# Altium schematic sheet Sheet_1 copy_2020-10-16_22-50-58.schdoc
size 312 x 186 mm
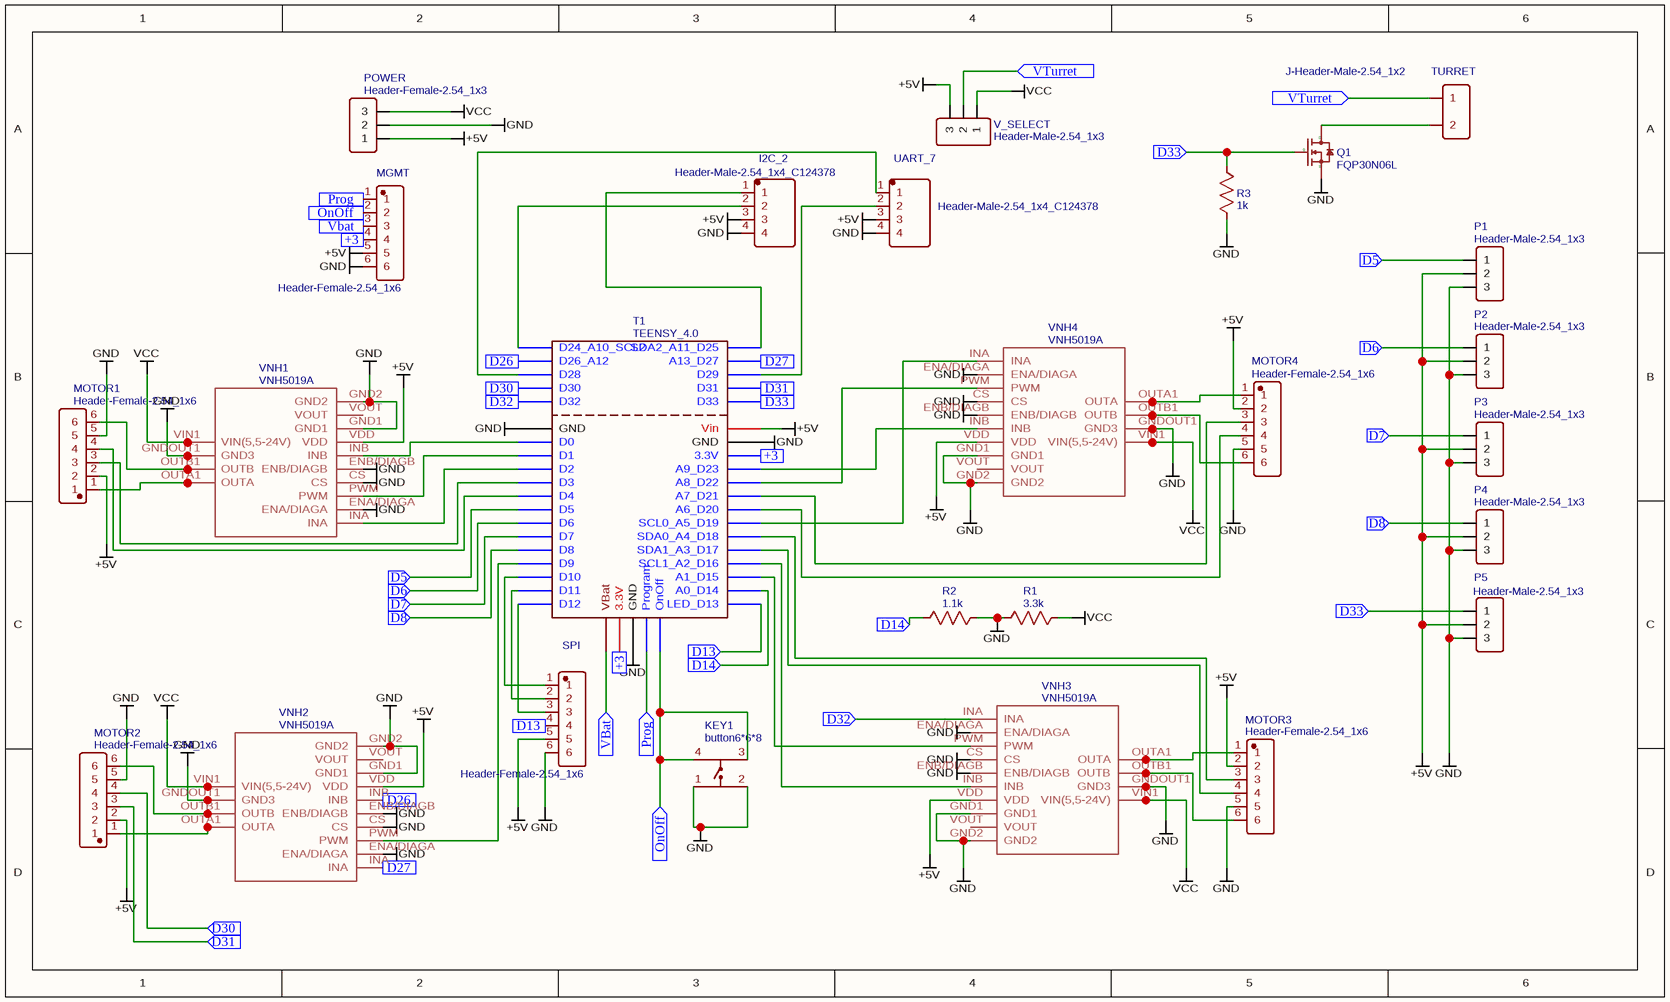
[diagram p0: Sheet_1 copy_2020-10-16_22-50-58.schdoc]

## Parts
I2C_2  Header-Male-2.54_1x4_C124378  [HDR-TH_4P-P2.54-V]
KEY1  button6*6*8  [KEY-TH_4P-L6.0-W6.0-P4.50-LS7.5]
MGMT  Header-Female-2.54_1x6  [HDR-TH_6P-P2.54-V]
MOTOR1  Header-Female-2.54_1x6  [HDR-TH_6P-P2.54-V]
MOTOR2  Header-Female-2.54_1x6  [HDR-TH_6P-P2.54-V]
MOTOR3  Header-Female-2.54_1x6  [HDR-TH_6P-P2.54-V]
MOTOR4  Header-Female-2.54_1x6  [HDR-TH_6P-P2.54-V]
P1  Header-Male-2.54_1x3  [HDR-TH_3P-P2.54-V]
P2  Header-Male-2.54_1x3  [HDR-TH_3P-P2.54-V]
P3  Header-Male-2.54_1x3  [HDR-TH_3P-P2.54-V]
P4  Header-Male-2.54_1x3  [HDR-TH_3P-P2.54-V]
P5  Header-Male-2.54_1x3  [HDR-TH_3P-P2.54-V]
POWER  Header-Female-2.54_1x3  [HDR-TH_3P-P2.54-V]
Q1  FQP30N06L  [TO-220]
R1  3.3k  [R0603]
R2  1.1k  [R0603]
R3  1k  [R0603]
SPI  Header-Female-2.54_1x6  [HDR-TH_6P-P2.54-V]
T1  TEENSY_4.0  [TEENSY_4.0]
TURRET  J-Header-Male-2.54_1x2  [HDR-2X1/2.54]
UART_7  Header-Male-2.54_1x4_C124378  [HDR-TH_4P-P2.54-V]
V_SELECT  Header-Male-2.54_1x3  [HDR-TH_3P-P2.54-V]
VNH1  VNH5019A  [VNH5019A]
VNH2  VNH5019A  [VNH5019A]
VNH3  VNH5019A  [VNH5019A]
VNH4  VNH5019A  [VNH5019A]

## Ports
+3 (in), D5 (in), D6 (in), D7 (in), D8 (in), D13 (in), D14 (in), D26 (in), D27 (in), D30 (in), D31 (in), D32 (in), D33 (in), OnOff (in), Prog (in), Vbat (in), VBat (in), VTurret (in)

## Nets
+5V: I2C_2.3 MGMT.5 MOTOR1.2 MOTOR2.2 MOTOR3.2 MOTOR4.2 P1.2 P2.2 P3.2 P4.2 P5.2 POWER.1 SPI.5 T1.Vin UART_7.3 V_SELECT.3 VNH1.VDD VNH2.VDD VNH3.VDD VNH4.VDD
GND: I2C_2.4 KEY1.1 KEY1.2 MGMT.6 MOTOR1.5 MOTOR2.5 MOTOR3.5 MOTOR4.5 P1.3 P2.3 P3.3 P4.3 P5.3 POWER.2 Q1.3(S) R1.1 R2.2 R3.1 SPI.6 T1.GND UART_7.4 VNH1.CS VNH1.ENA/DIAGA VNH1.ENB/DIAGB VNH1.GND1 VNH1.GND2 VNH1.GNDOUT1(GND3) VNH1.GNDOUT2(GND3) VNH1.GNDOUT3(GND3) VNH2.CS VNH2.ENA/DIAGA VNH2.ENB/DIAGB VNH2.GND1 VNH2.GND2 VNH2.GNDOUT1(GND3) VNH2.GNDOUT2(GND3) VNH2.GNDOUT3(GND3) VNH3.CS VNH3.ENA/DIAGA VNH3.ENB/DIAGB VNH3.GND1 VNH3.GND2 VNH3.GNDOUT1(GND3) VNH3.GNDOUT2(GND3) VNH3.GNDOUT3(GND3) VNH4.CS VNH4.ENA/DIAGA VNH4.ENB/DIAGB VNH4.GND1 VNH4.GND2 VNH4.GNDOUT1(GND3) VNH4.GNDOUT2(GND3) VNH4.GNDOUT3(GND3)
VCC: POWER.3 R1.2 V_SELECT.1 VNH1.VIN1(VIN(5,5-24V)) VNH1.VIN2(VIN(5,5-24V)) VNH1.VIN3(VIN(5,5-24V)) VNH2.VIN1(VIN(5,5-24V)) VNH2.VIN2(VIN(5,5-24V)) VNH2.VIN3(VIN(5,5-24V)) VNH3.VIN1(VIN(5,5-24V)) VNH3.VIN2(VIN(5,5-24V)) VNH3.VIN3(VIN(5,5-24V)) VNH4.VIN1(VIN(5,5-24V)) VNH4.VIN2(VIN(5,5-24V)) VNH4.VIN3(VIN(5,5-24V))
+3: MGMT.4 T1.3.3V ; port +3
D5: P1.1 T1.D5 ; port D5
D6: P2.1 T1.D6 ; port D6
D7: P3.1 T1.D7 ; port D7
D8: P4.1 T1.D8 ; port D8
D13: SPI.4 T1.LED_D13 ; port D13
D14: R2.1 T1.A0_D14 ; port D14
D26: T1.D26_A12 VNH2.INB ; port D26
D27: T1.A13_D27 VNH2.INA ; port D27
D30: MOTOR2.4 T1.D30 ; port D30
D31: MOTOR2.3 T1.D31 ; port D31
D32: T1.D32 VNH3.INA ; port D32
D33: P5.1 Q1.1(G) R3.2 T1.D33 ; port D33
OnOff: KEY1.3 KEY1.4 MGMT.2 T1.OnOff ; port OnOff
Prog: MGMT.1 T1.Program ; port Prog
Vbat: MGMT.3 T1.VBat ; port Vbat, port VBat
VTurret: TURRET.1 V_SELECT.2 ; port VTurret
NetI2C_2_1: I2C_2.1 T1.SDA2_A11_D25
NetI2C_2_2: I2C_2.2 T1.D24_A10_SCL2
NetMOTOR1_1: MOTOR1.1 VNH1.OUTA1(OUTA) VNH1.OUTA2(OUTA) VNH1.OUTA3(OUTA)
NetMOTOR1_3: MOTOR1.3 T1.D3
NetMOTOR1_4: MOTOR1.4 T1.D4
NetMOTOR1_6: MOTOR1.6 VNH1.OUTB1(OUTB) VNH1.OUTB2(OUTB) VNH1.OUTB3(OUTB)
NetMOTOR2_1: MOTOR2.1 VNH2.OUTA1(OUTA) VNH2.OUTA2(OUTA) VNH2.OUTA3(OUTA)
NetMOTOR2_6: MOTOR2.6 VNH2.OUTB1(OUTB) VNH2.OUTB2(OUTB) VNH2.OUTB3(OUTB)
NetMOTOR3_1: MOTOR3.1 VNH3.OUTA1(OUTA) VNH3.OUTA2(OUTA) VNH3.OUTA3(OUTA)
NetMOTOR3_3: MOTOR3.3 T1.SDA0_A4_D18
NetMOTOR3_4: MOTOR3.4 T1.SDA1_A3_D17
NetMOTOR3_6: MOTOR3.6 VNH3.OUTB1(OUTB) VNH3.OUTB2(OUTB) VNH3.OUTB3(OUTB)
NetMOTOR4_1: MOTOR4.1 VNH4.OUTA1(OUTA) VNH4.OUTA2(OUTA) VNH4.OUTA3(OUTA)
NetMOTOR4_3: MOTOR4.3 T1.A7_D21
NetMOTOR4_4: MOTOR4.4 T1.A6_D20
NetMOTOR4_6: MOTOR4.6 VNH4.OUTB1(OUTB) VNH4.OUTB2(OUTB) VNH4.OUTB3(OUTB)
NetQ1_2: Q1.2(D) TURRET.2
NetSPI_1: SPI.1 T1.D10
NetSPI_2: SPI.2 T1.D11
NetSPI_3: SPI.3 T1.D12
NetT1_A1_D15: T1.A1_D15 VNH3.PWM
NetT1_A8_D22: T1.A8_D22 VNH4.PWM
NetT1_A9_D23: T1.A9_D23 VNH4.INB
NetT1_D0: T1.D0 VNH1.INB
NetT1_D1: T1.D1 VNH1.PWM
NetT1_D2: T1.D2 VNH1.INA
NetT1_D9: T1.D9 VNH2.PWM
NetT1_D28: T1.D28 UART_7.1
NetT1_D29: T1.D29 UART_7.2
NetT1_SCL0_A5_D19: T1.SCL0_A5_D19 VNH4.INA
NetT1_SCL1_A2_D16: T1.SCL1_A2_D16 VNH3.INB

Not connected (* = marked no-connect by the designer): VNH1 VOUT; VNH2 VOUT; VNH3 VOUT; VNH4 VOUT

## Library data of the parts
I2C_2 UART_7 = Header-Male-2.54_1x4_C124378: BOM_Manufacturer: Ckmtw; BOM_Manufacturer Part: 210S-1*4P L=11.6MMGold-plated black; Contributor: LCSC; BOM_Supplier: LCSC; BOM_Supplier Part: C124378; spicePre: H; spiceSymbolName: Header-Male-2.54_1x4_C124378
KEY1 = button6*6*8: BOM_Manufacturer: ReliaPro; BOM_Supplier Part: C59982; BOM_Supplier: LCSC; BOM_Manufacturer Part: button6*6*8; image: http://image.lceda.cn/szlcsc/C59982.jpg; spicePre: K; spiceSymbolName: button6*6*8
MGMT MOTOR1-MOTOR4 SPI = Header-Female-2.54_1x6: BOM_Manufacturer: BOOMELE; BOM_Manufacturer Part: Female header 1*6p; BOM_Supplier: LCSC; BOM_Supplier Part: C40877; spicePre: P; spiceSymbolName: Header-Female-2.54_1x6
P1-P5 V_SELECT = Header-Male-2.54_1x3: BOM_Manufacturer: BOOMELE; BOM_Manufacturer Part: Header2.54mm 1*3P; BOM_Supplier: LCSC; image: //image.lceda.cn/szlcsc/C49257.jpg; BOM_Supplier Part: C49257; spicePre: H; spiceSymbolName: Header-Male-2.54_1x3
POWER = Header-Female-2.54_1x3: BOM_Manufacturer: Boom Precision Elec; BOM_Supplier Part: C146243; BOM_Supplier: LCSC; BOM_Manufacturer Part: Header-Female-2.54_1x3; link: https://datasheet.lcsc.com/szlcsc/Boom-Precision-Elec-2-54mm-1-8P-Straight-Female-header_C27438.pdf; spicePre: P; spiceSymbolName: Header-Female-2.54_1x3
Q1 = FQP30N06L: sourceId: lTtPN9uQc; timeStamp: 1448358615; spicePre: Q; spiceSymbolName: FQP30N06L
R1 = 3.3k: nameAlias: Value(Ω); Contributor: LCEDA_Lib; spicePre: R; spiceSymbolName: R_0603_US
R2 = 1.1k: nameAlias: Value(Ω); Contributor: LCEDA_Lib; spicePre: R; spiceSymbolName: R_0603_US
R3 = 1k: nameAlias: Value(Ω); Contributor: LCEDA_Lib; spicePre: R; spiceSymbolName: R_0603_US
T1 = TEENSY_4.0: BOM_Manufacturer Part: Teensy 4.0; Contributor: ghoare; BOM_Mounted: Yes; BOM_Supplier Part: TEENSY40; BOM_Supplier: PJRC; link: https://www.pjrc.com/teensy/index.html; spicePre: T; spiceSymbolName: TEENSY_4.0
TURRET = J-Header-Male-2.54_1x2: BOM_Manufacturer: TE Connectivity; BOM_Manufacturer Part: 826629-2; BOM_Supplier Part: C86471; BOM_Supplier: LCSC; image: //image.lceda.cn/szlcsc/C86471.jpg; link: //image.lceda.cn/szlcsc/C86471.jpg; spicePre: J; spiceSymbolName: J-Header-Male-2.54_1x2
VNH1-VNH4 = VNH5019A: Contributor: RoverOva; spicePre: V; spiceSymbolName: VNH5019A